# EAGLE design controller (EAGLE 7.7.0)
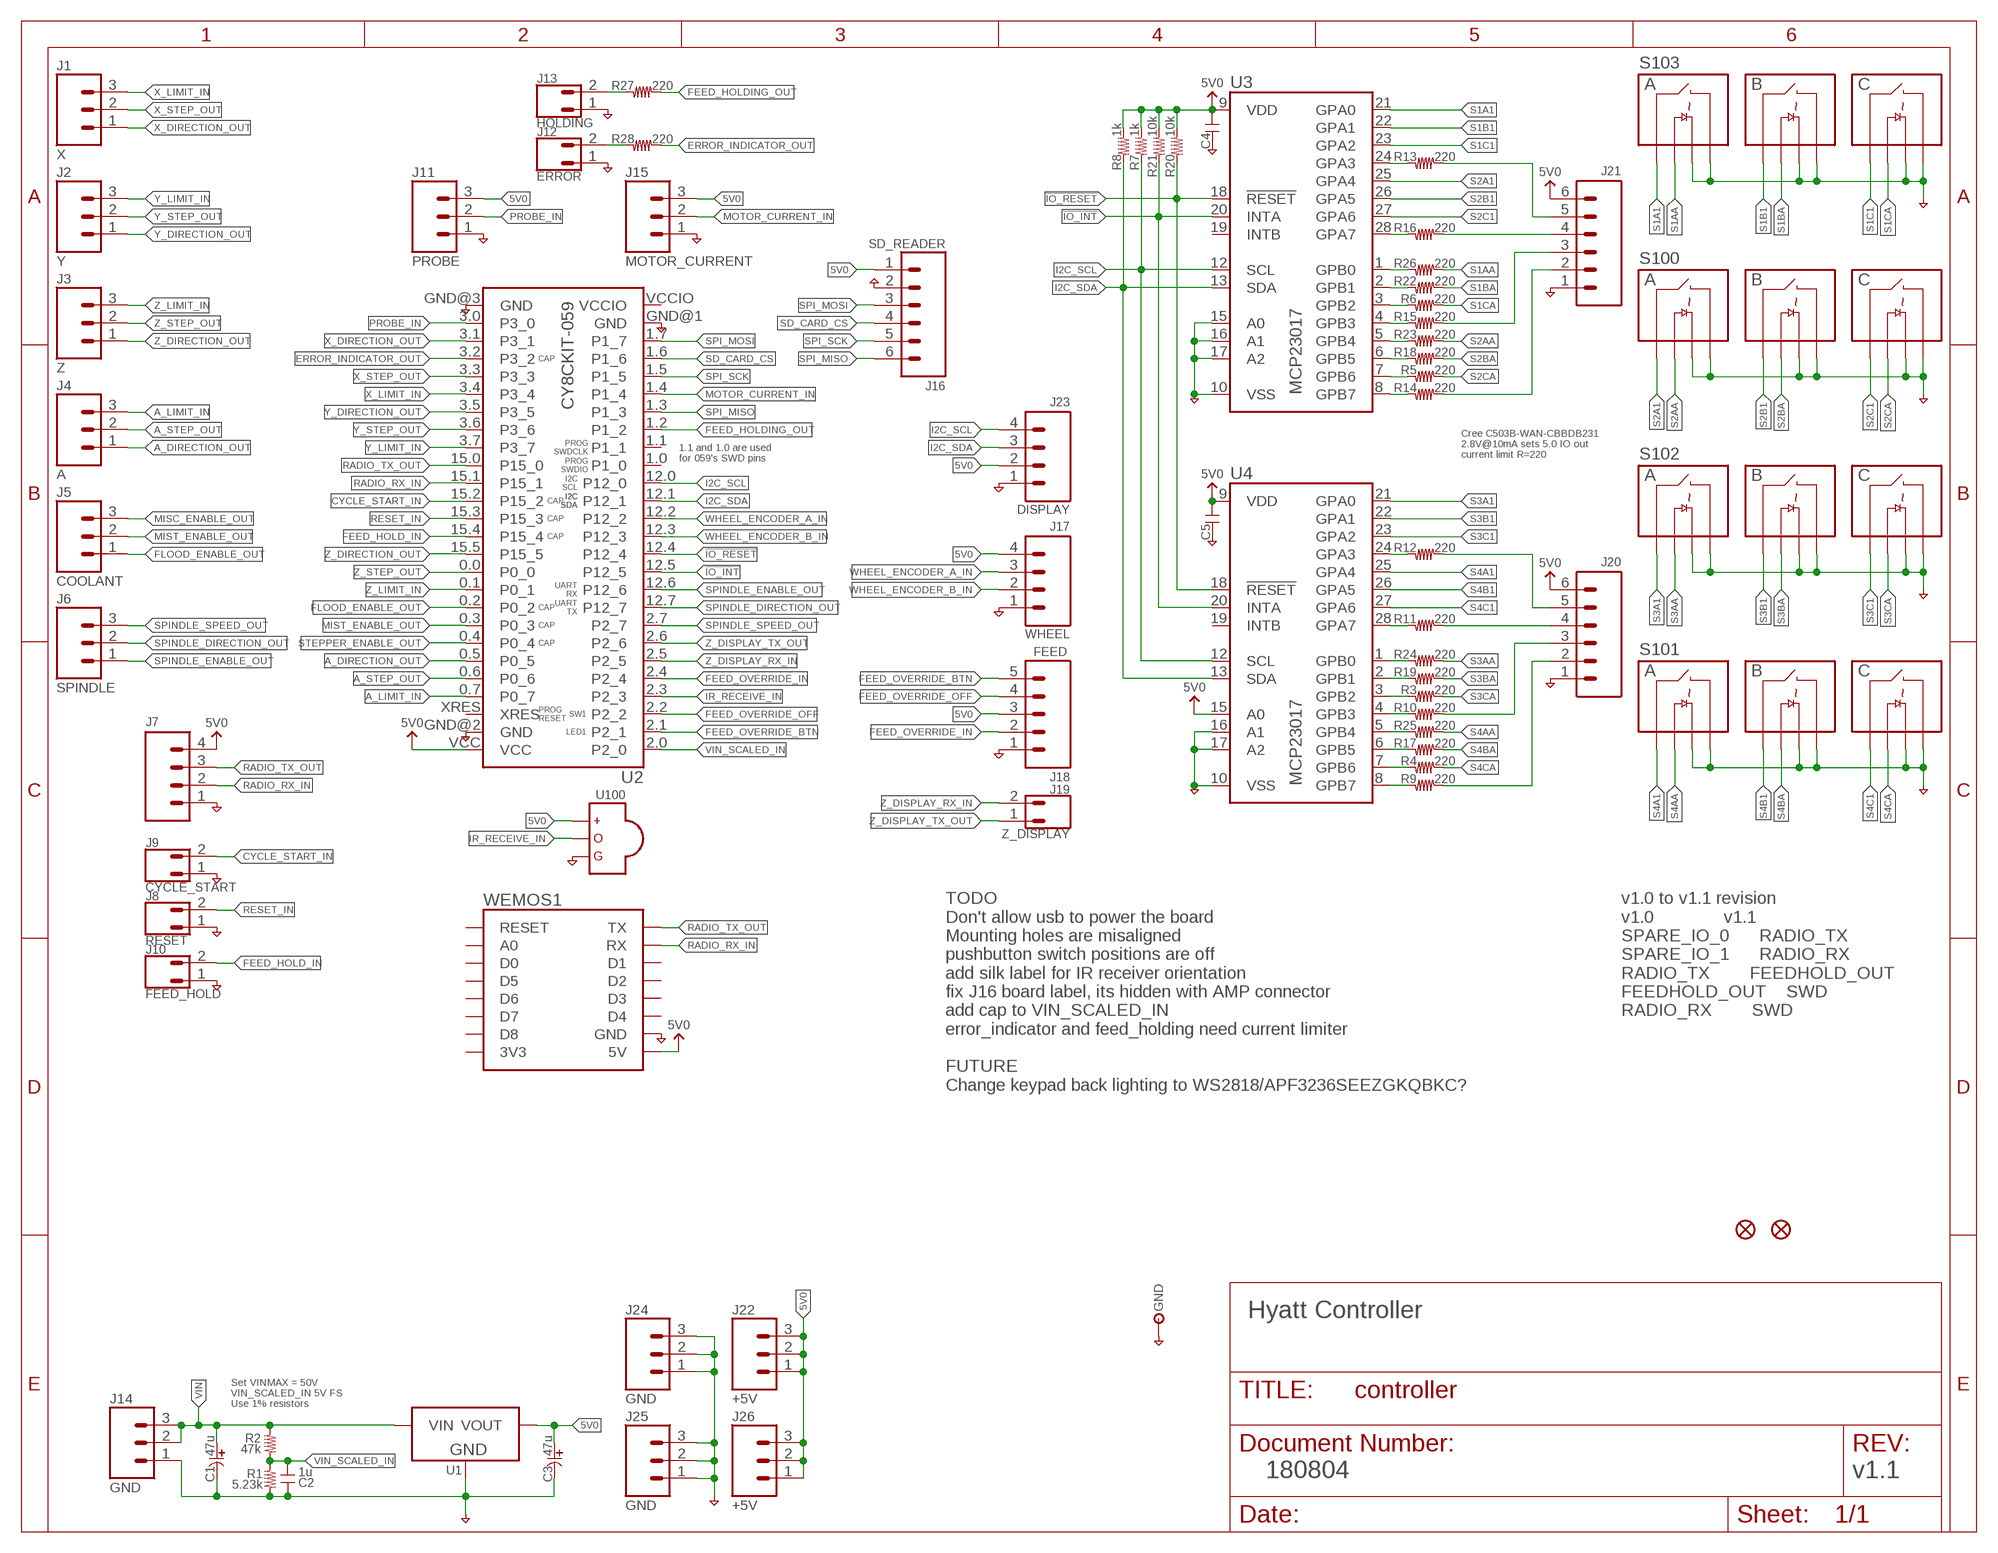
[diagram p0: schematic, sheet 1]

## Parts
C1  47u  C-POLARIZED-E5-10  [E5-10]
C2  1u  C-0603  [C0603]
C3  47u  C-POLARIZED-E5-10  [E5-10]
C4  C-0603  [C0603]
C5  C-0603  [C0603]
FID1  FIDUCIAL1.5X3  [FIDUCIAL-1.5X3]
FID2  FIDUCIAL1.5X3  [FIDUCIAL-1.5X3]
GND  TESTPOINTTHRU  [TPTHRU]
J1  X  CONN-03-3.81MM-PLUGIN-SCREW  [CONN-3.81MM-KF2EDG-3]
J2  Y  CONN-03-3.81MM-PLUGIN-SCREW  [CONN-3.81MM-KF2EDG-3]
J3  Z  CONN-03-3.81MM-PLUGIN-SCREW  [CONN-3.81MM-KF2EDG-3]
J4  A  CONN-03-3.81MM-PLUGIN-SCREW  [CONN-3.81MM-KF2EDG-3]
J5  COOLANT  CONN-03-3.81MM-PLUGIN-SCREW  [CONN-3.81MM-KF2EDG-3]
J6  SPINDLE  CONN-03-3.81MM-PLUGIN-SCREW  [CONN-3.81MM-KF2EDG-3]
J7  CONN-04-0.1  [1X04]
J8  RESET  CONN-02-.100-VERT-HEADER  [CONN-.100-2]
J9  CYCLE_START  CONN-02-.100-VERT-HEADER  [CONN-.100-2]
J10  FEED_HOLD  CONN-02-.100-VERT-HEADER  [CONN-.100-2]
J11  PROBE  CONN-03-3.81MM-PLUGIN-SCREW  [CONN-3.81MM-KF2EDG-3]
J12  ERROR  CONN-02-.100-VERT-HEADER  [CONN-.100-2]
J13  HOLDING  CONN-02-.100-VERT-HEADER  [CONN-.100-2]
J14  GND  CONN-03-3.81MM-PLUGIN-SCREW  [CONN-3.81MM-KF2EDG-3]
J15  MOTOR_CURRENT  CONN-03-3.81MM-PLUGIN-SCREW  [CONN-3.81MM-KF2EDG-3]
J16  SD_READER  CONN-06-0.1  [1X06]
J17  WHEEL  CONN-04-.100-VERT-HEADER  [CONN-.100-4]
J18  FEED  CONN-05-PTH  [1X05]
J19  Z_DISPLAY  CONN-02-3.81MM-PLUGIN-SCREW  [CONN-3.81MM-KF2EDG-2]
J20  CONN-06-.100-VERT-HEADER  [CONN-.100-6]
J21  CONN-06-.100-VERT-HEADER  [CONN-.100-6]
J22  +5V  CONN-03-3.81MM-PLUGIN-SCREW  [CONN-3.81MM-KF2EDG-3]
J23  DISPLAY  CONN-04-.100-VERT-HEADER  [CONN-.100-4]
J24  GND  CONN-03-3.81MM-PLUGIN-SCREW  [CONN-3.81MM-KF2EDG-3]
J25  GND  CONN-03-3.81MM-PLUGIN-SCREW  [CONN-3.81MM-KF2EDG-3]
J26  +5V  CONN-03-3.81MM-PLUGIN-SCREW  [CONN-3.81MM-KF2EDG-3]
R1  5.23k  R-0603  [R0603]
R2  47k  R-0603  [R0603]
R3  220  R-0603  [R0603]
R4  220  R-0603  [R0603]
R5  220  R-0603  [R0603]
R6  220  R-0603  [R0603]
R7  1k  R-0603  [R0603]
R8  1k  R-0603  [R0603]
R9  220  R-0603  [R0603]
R10  220  R-0603  [R0603]
R11  220  R-0603  [R0603]
R12  220  R-0603  [R0603]
R13  220  R-0603  [R0603]
R14  220  R-0603  [R0603]
R15  220  R-0603  [R0603]
R16  220  R-0603  [R0603]
R17  220  R-0603  [R0603]
R18  220  R-0603  [R0603]
R19  220  R-0603  [R0603]
R20  10k  R-0603  [R0603]
R21  10k  R-0603  [R0603]
R22  220  R-0603  [R0603]
R23  220  R-0603  [R0603]
R24  220  R-0603  [R0603]
R25  220  R-0603  [R0603]
R26  220  R-0603  [R0603]
R27  220  R-0603  [R0603]
R28  220  R-0603  [R0603]
S100  SWITCH-DTMF-3-LED  [SWITCH-DTMF-3-LED]
S101  SWITCH-DTMF-3-LED  [SWITCH-DTMF-3-LED]
S102  SWITCH-DTMF-3-LED  [SWITCH-DTMF-3-LED]
S103  SWITCH-DTMF-3-LED  [SWITCH-DTMF-3-LED]
U1  VREG-SIP3  [VREG-SIP3]
U2  BOARD-PSOC-CY8CKIT-059  [BOARD-PSOC-CY8CKIT-059]
U3  MCP23017  IO-MCP23017SO  [SO28W]
U4  MCP23017  IO-MCP23017SO  [SO28W]
U100  SENSOR-IR-THRU  [IRDETECTOR-THRU]
WEMOS1  RADIO-WEMOS-D1-MINI  [WEMOS-D1-MINI]

## Nets
5V0: C3.+ C4.1 C5.1 J7.4 J11.3 J15.3 J16.1 J17.4 J18.3 J20.6 J21.6 J22.1 J22.2 J22.3 J23.2 J26.1 J26.2 J26.3 R7.2 R8.2 R20.2 R21.2 U1.3(VOUT) U2.VCC U3.9(VDD) U4.9(VDD) U4.15(A0) U100.VCC WEMOS1.5V
!IO_INT: R21.1 U2.12.5(P12_5) U3.20(INTA) U4.20(INTA)
!IO_RESET: R20.1 U2.12.4(P12_4) U3.18(!RESET) U4.18(!RESET)
A_DIRECTION_OUT: J4.1 U2.0.5(P0_5)
A_LIMIT_IN: J4.3 U2.0.7(P0_7)
A_STEP_OUT: J4.2 U2.0.6(P0_6)
CYCLE_START_IN: J9.2 U2.15.2(P15_2)
ERROR_INDICATOR_OUT: R28.2 U2.3.2(P3_2)
FEED_HOLD_IN: J10.2 U2.15.4(P15_4)
FEED_HOLDING_OUT: R27.2 U2.1.2(P1_2)
FEED_OVERRIDE_BTN: J18.5 U2.2.1(P2_1)
FEED_OVERRIDE_IN: J18.2 U2.2.4(P2_4)
FEED_OVERRIDE_OFF: J18.4 U2.2.2(P2_2)
FLOOD_ENABLE_OUT: J5.1 U2.0.2(P0_2)
GND: C1.- C2.2 C3.- C4.2 C5.2 GND.1 J7.1 J8.1 J9.1 J10.1 J11.1 J12.1 J13.1 J14.1 J15.1 J16.2 J17.1 J18.1 J20.1 J21.1 J23.1 J24.1 J24.2 J24.3 J25.1 J25.2 J25.3 R1.1 S100.A_2 S100.A_C S100.B_2 S100.B_C S100.C_2 S100.C_C S101.A_2 S101.A_C S101.B_2 S101.B_C S101.C_2 S101.C_C S102.A_2 S102.A_C S102.B_2 S102.B_C S102.C_2 S102.C_C S103.A_2 S103.A_C S103.B_2 S103.B_C S103.C_2 S103.C_C U1.2(GND) U2.GND@1(GND) U2.GND@2(GND) U2.GND@3(GND) U3.10(VSS) U3.15(A0) U3.16(A1) U3.17(A2) U4.10(VSS) U4.16(A1) U4.17(A2) U100.GND WEMOS1.GND
I2C_SCL: J23.4 R7.1 U2.12.0(P12_0) U3.12(SCL) U4.12(SCL)
I2C_SDA: J23.3 R8.1 U2.12.1(P12_1) U3.13(SDA) U4.13(SDA)
IR_RECEIVE_IN: U2.2.3(P2_3) U100.VOUT
MISC_ENABLE_OUT: J5.3
MIST_ENABLE_OUT: J5.2 U2.0.3(P0_3)
MOTOR_CURRENT_IN: J15.2 U2.1.4(P1_4)
N$1: R26.1 U3.1(GPB0)
N$2: R22.1 U3.2(GPB1)
N$3: R13.1 U3.24(GPA3)
N$4: J21.5 R13.2
N$5: R16.1 U3.28(GPA7)
N$6: J21.3 R15.2
N$7: J21.4 R16.2
N$8: R12.1 U4.24(GPA3)
N$9: R11.1 U4.28(GPA7)
N$10: J20.5 R12.2
N$11: J20.4 R11.2
N$12: J13.2 R27.1
N$13: J12.2 R28.1
N$15: R6.1 U3.3(GPB2)
N$16: R15.1 U3.4(GPB3)
N$17: R23.1 U3.5(GPB4)
N$18: R18.1 U3.6(GPB5)
N$19: R5.1 U3.7(GPB6)
N$20: R14.1 U3.8(GPB7)
N$21: R24.1 U4.1(GPB0)
N$22: R19.1 U4.2(GPB1)
N$23: R3.1 U4.3(GPB2)
N$24: R10.1 U4.4(GPB3)
N$25: R25.1 U4.5(GPB4)
N$26: R17.1 U4.6(GPB5)
N$27: R4.1 U4.7(GPB6)
N$28: R9.1 U4.8(GPB7)
N$30: J21.2 R14.2
N$44: J20.3 R10.2
N$48: J20.2 R9.2
PROBE_IN: J11.2 U2.3.0(P3_0)
RADIO_RX_IN: J7.2 U2.15.1(P15_1) WEMOS1.RX
RADIO_TX_OUT: J7.3 U2.15.0(P15_0) WEMOS1.TX
RESET_IN: J8.2 U2.15.3(P15_3)
S1A1: S103.A_1 U3.21(GPA0)
S1AA: R26.2 S103.A_A
S1B1: S103.B_1 U3.22(GPA1)
S1BA: R22.2 S103.B_A
S1C1: S103.C_1 U3.23(GPA2)
S1CA: R6.2 S103.C_A
S2A1: S100.A_1 U3.25(GPA4)
S2AA: R23.2 S100.A_A
S2B1: S100.B_1 U3.26(GPA5)
S2BA: R18.2 S100.B_A
S2C1: S100.C_1 U3.27(GPA6)
S2CA: R5.2 S100.C_A
S3A1: S102.A_1 U4.21(GPA0)
S3AA: R24.2 S102.A_A
S3B1: S102.B_1 U4.22(GPA1)
S3BA: R19.2 S102.B_A
S3C1: S102.C_1 U4.23(GPA2)
S3CA: R3.2 S102.C_A
S4A1: S101.A_1 U4.25(GPA4)
S4AA: R25.2 S101.A_A
S4B1: S101.B_1 U4.26(GPA5)
S4BA: R17.2 S101.B_A
S4C1: S101.C_1 U4.27(GPA6)
S4CA: R4.2 S101.C_A
SD_CARD_CS: J16.4 U2.1.6(P1_6)
SPI_MISO: J16.6 U2.1.3(P1_3)
SPI_MOSI: J16.3 U2.1.7(P1_7)
SPI_SCK: J16.5 U2.1.5(P1_5)
SPINDLE_DIRECTION_OUT: J6.2 U2.12.7(P12_7)
SPINDLE_ENABLE_OUT: J6.1 U2.12.6(P12_6)
SPINDLE_SPEED_OUT: J6.3 U2.2.7(P2_7)
STEPPER_ENABLE_OUT: U2.0.4(P0_4)
VIN: C1.+ J14.2 J14.3 R2.2 U1.1(VIN)
VIN_SCALED_IN: C2.1 R1.2 R2.1 U2.2.0(P2_0)
WHEEL_ENCODER_A_IN: J17.3 U2.12.2(P12_2)
WHEEL_ENCODER_B_IN: J17.2 U2.12.3(P12_3)
X_DIRECTION_OUT: J1.1 U2.3.1(P3_1)
X_LIMIT_IN: J1.3 U2.3.4(P3_4)
X_STEP_OUT: J1.2 U2.3.3(P3_3)
Y_DIRECTION_OUT: J2.1 U2.3.5(P3_5)
Y_LIMIT_IN: J2.3 U2.3.7(P3_7)
Y_STEP_OUT: J2.2 U2.3.6(P3_6)
Z_DIRECTION_OUT: J3.1 U2.15.5(P15_5)
Z_DISPLAY_RX_IN: J19.2 U2.2.5(P2_5)
Z_DISPLAY_TX_OUT: J19.1 U2.2.6(P2_6)
Z_LIMIT_IN: J3.3 U2.0.1(P0_1)
Z_STEP_OUT: J3.2 U2.0.0(P0_0)
Unconnected: U2.1.0(P1_0) U2.1.1(P1_1) U2.VCCIO U2.XRES U3.19(INTB) U4.19(INTB) WEMOS1.3V3 WEMOS1.A0 WEMOS1.D0 WEMOS1.D1 WEMOS1.D2 WEMOS1.D3 WEMOS1.D4 WEMOS1.D5 WEMOS1.D6 WEMOS1.D7 WEMOS1.D8 WEMOS1.RESET

## Notes on the sheet
- Cree C503B-WAN-CBBDB231
  2.8V@10mA sets 5.0 IO out
  current limit R=220
- 1.1 and 1.0 are used
  for 059's SWD pins
- TODO
  Don't allow usb to power the board
  Mounting holes are misaligned
  pushbutton switch positions are off
  add silk label for IR receiver orientation
  fix J16 board label, its hidden with AMP connector
  add cap to VIN_SCALED_IN
  error_indicator and feed_holding need current limiter
  
  FUTURE
  Change keypad back lighting to WS2818/APF3236SEEZGKQBKC?
- v1.0 to v1.1 revision
  v1.0              v1.1
  SPARE_IO_0      RADIO_TX
  SPARE_IO_1      RADIO_RX
  RADIO_TX        FEEDHOLD_OUT
  FEEDHOLD_OUT    SWD
  RADIO_RX        SWD
- Hyatt Controller
- Set VINMAX = 50V
  VIN_SCALED_IN 5V FS
  Use 1% resistors
- 180804 | v1.1

## Library data of the parts
C1 C3 = holla:C-POLARIZED
C2 C4 C5 = holla:C
FID1 FID2 = holla:FIDUCIAL: Fiducial Alignment Points Various fiducial points for machine vision alignment.; DNP: 1
GND = holla:TESTPOINT; DNP: 1
J1-J6 J11 J14 J15 J22 J24-J26 = holla:CONN-03
J7 J17 J23 = holla:CONN-04
J8-J10 J12 J13 J19 = holla:CONN-02: CONN HEADER 2POS
J16 J20 J21 = holla:CONN-06
J18 = holla:CONN-05: Header 5 Standard 5-pin 0.1" header. Use with straight break away headers (SKU : PRT-00116), right angle break away headers (PRT-00553), swiss pins (PRT-00743), machine pins (PRT-00117), and female headers (PRT-00115). Molex polarized connector foot print use with SKU : PRT-08230 with associated crimp pins and housings.
R1-R28 = holla:R; DESC: 5%
S100-S103 = holla:SWITCH-DTMF-3-LED
U1 = holla:VREG: Various 3 pin voltage regulators in different packages Double check the right pinout for the right part
U2 = holla:BOARD-PSOC-CY8CKIT-059
U3 U4 = holla:IO-MCP23017: 16-bit input/output port expander with interrupt output http://ww1.microchip.com/downloads/en/DeviceDoc/21952a.pdf Source: http://ww1.microchip.com/downloads/en/DeviceDoc/21952a.pdf; MF: MICROCHIP; MPN: MCP23017-E/SO; OC_FARNELL: 1332087; OC_NEWARK: 31K2958
U100 = holla:SENSOR-IR: IR Detector PTH equiv GP1UX311QS or TSOP38238 SMD TSOP6238TT
WEMOS1 = holla:RADIO-WEMOS-D1-MINI: WeMos.cc D1 mini ESP8266 module

## Board
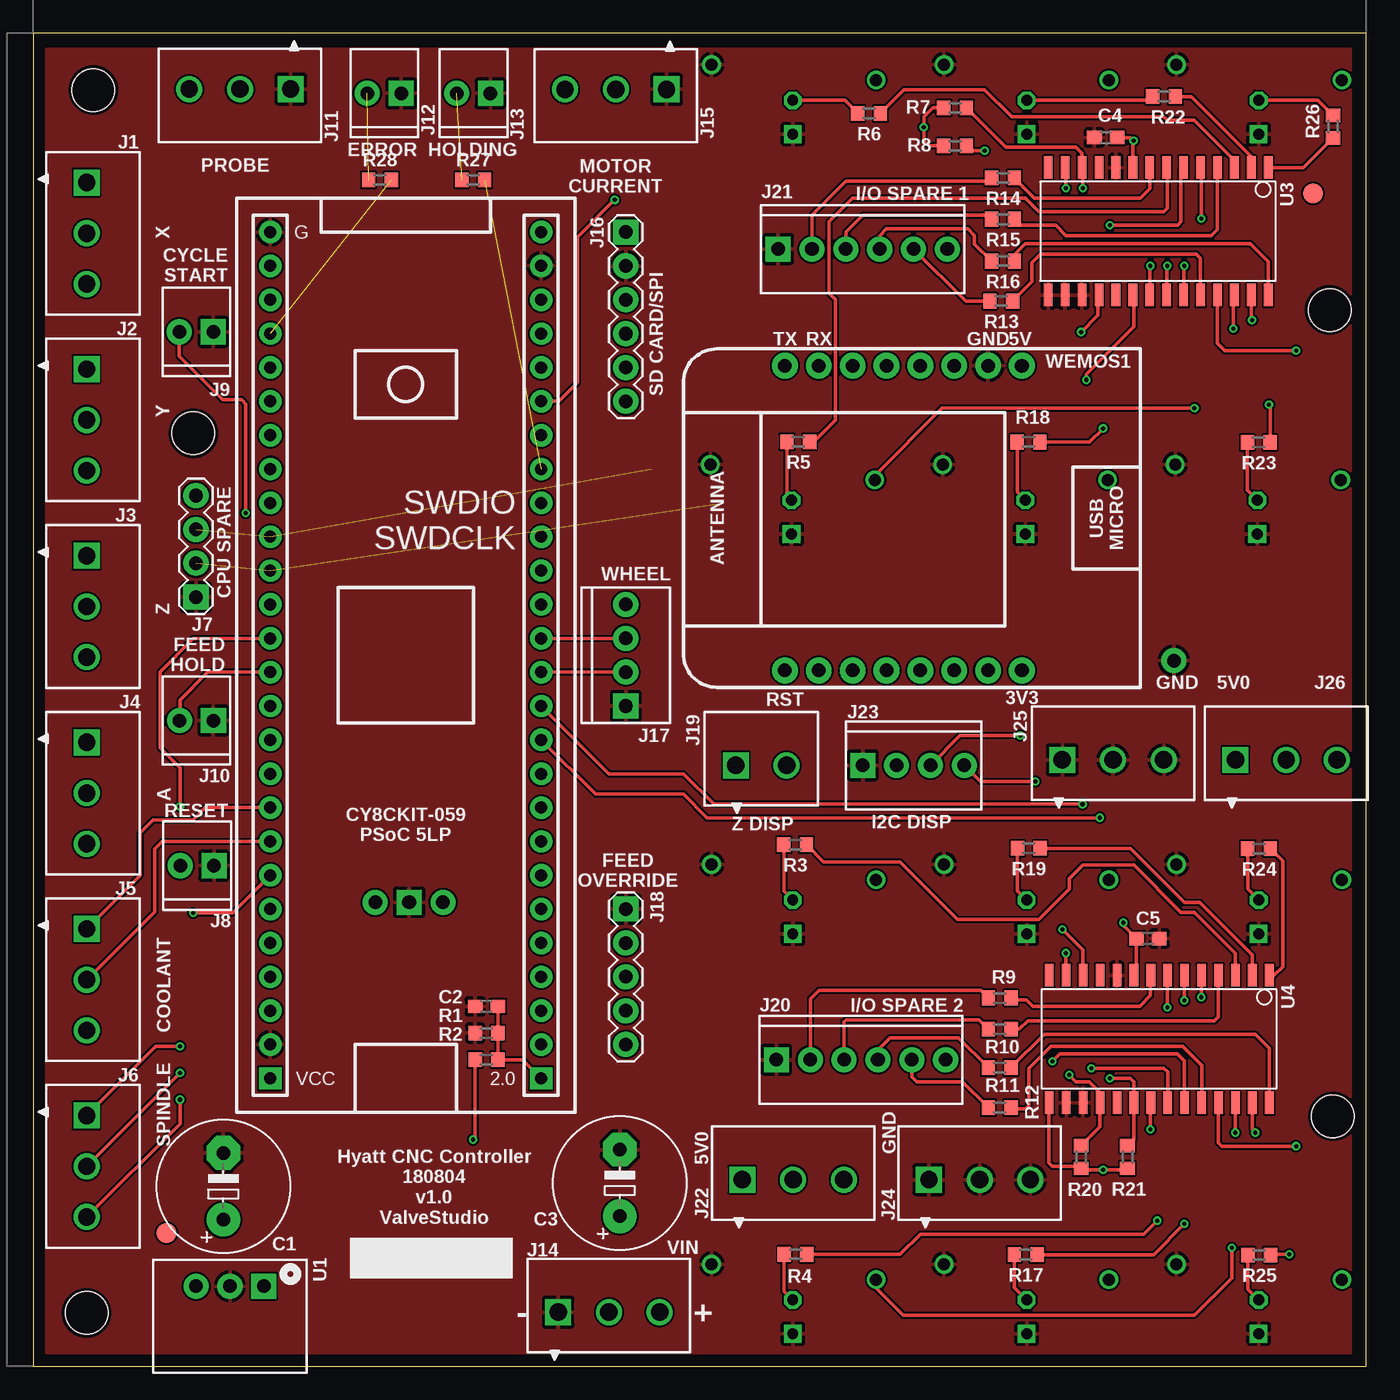
[diagram p1: board, top side]
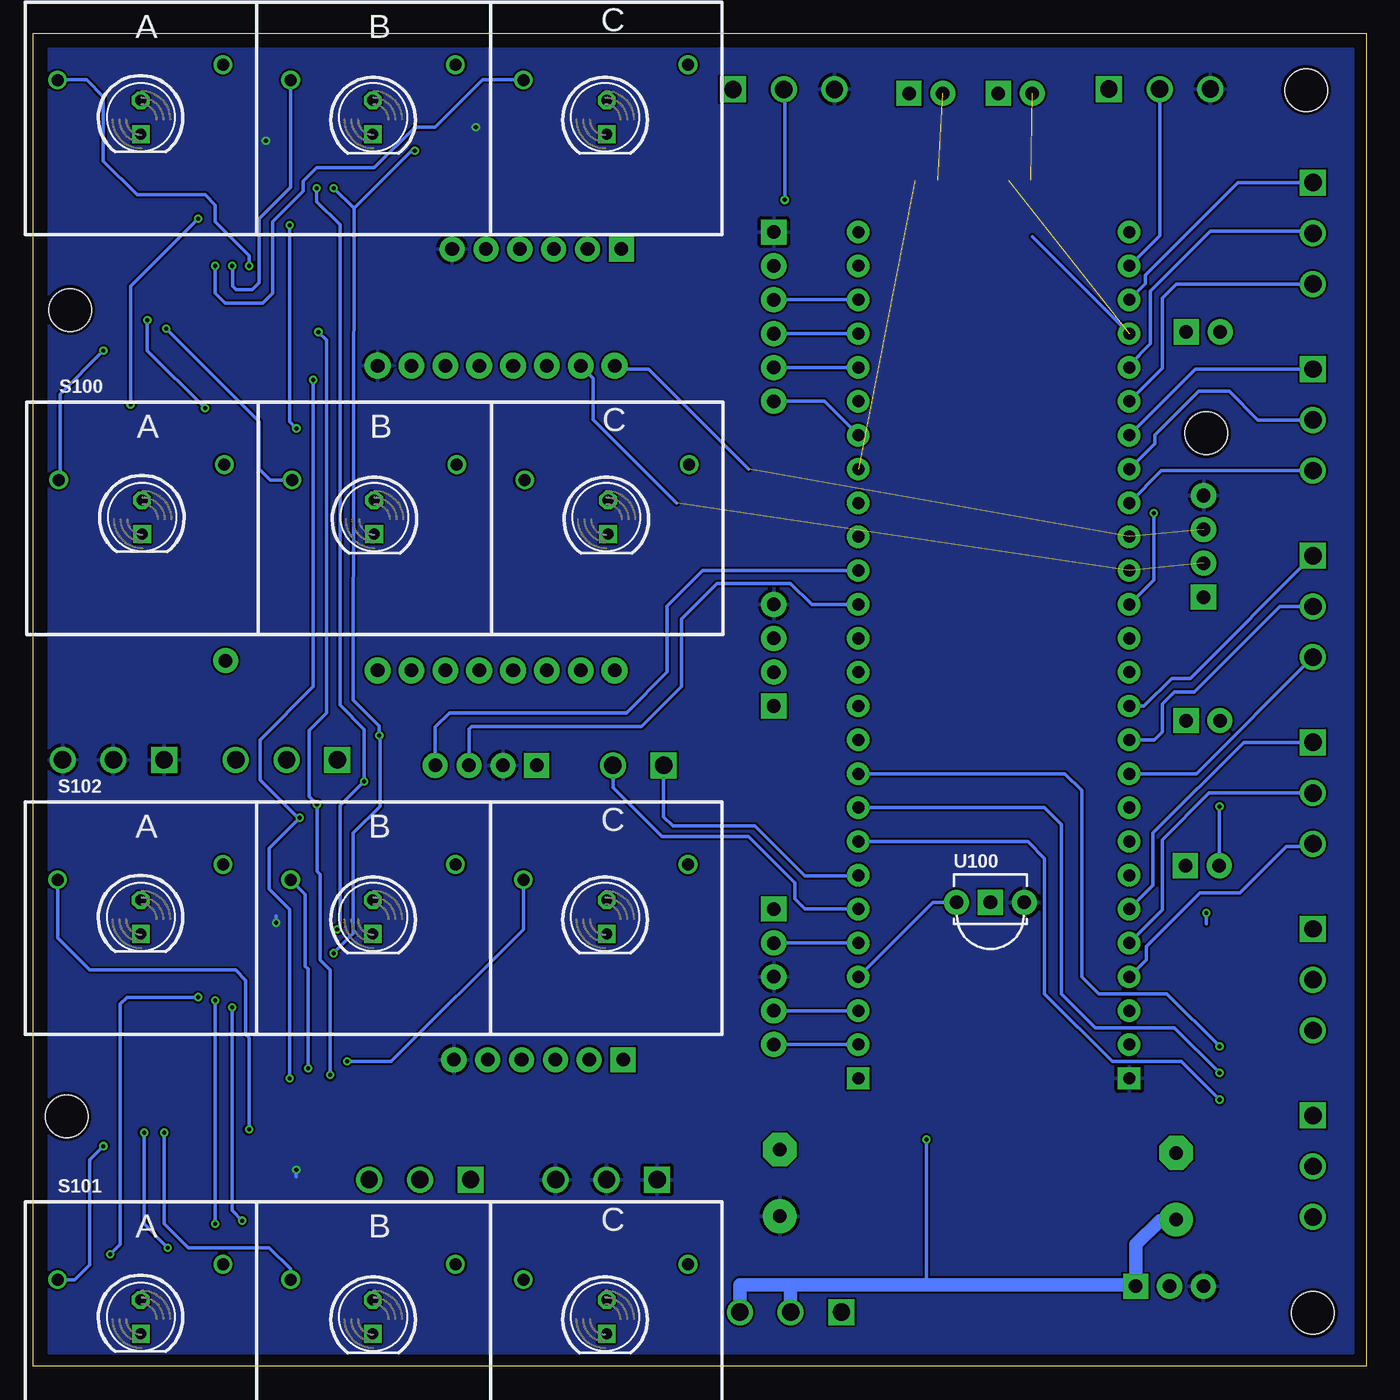
[diagram p2: board, bottom side, seen from below]

Size 100 x 100 mm. Coordinates in mm from the lower left corner, seen from the top.
Outline: 0,0 100,0 100,100 0,100 0,0
Copper layers (1*16): Top 0.035mm / dielectric 1.5mm / Bottom 0.035mm
Design rules "Fusion_eagle_rule_v1.1": minimum track width 6mil, minimum drill 12mil, track to track 6mil, track to pad 6mil, pad to pad 6mil, via to via 6mil, smd to smd 0mil, copper to edge 10mil, drill to drill 10mil, minimum pad ring 10mil, minimum via ring 6mil, stop-mask expansion 2mil, vias tented up to drill 100mil, thermal gap 10mil
Holes 3.2 mm at 97.25,79.25 97.5,18.75 4.5,95.75 4,4 12,70

### Footprints (pad centres in the part's own frame; a part is rotated, then mirrored left to right if it is on the bottom)
E5-10 = drill 1.016 pad 2.54: + -2.5,0 | drill 1.016 pad 2.54 octagon: - 2.5,0
C0603 = smd 1.1 x 1: 1 -0.85,0; 2 0.85,0
FIDUCIAL-1.5X3 = smd 1.5 x 1.5: 1 0,0
TPTHRU = drill 1.016 pad 1.88: 1 0,0
CONN-3.81MM-KF2EDG-3 = drill 1.3 square: 1 -3.81,0 | drill 1.3: 2 0,0; 3 3.81,0
1X04 = drill 1.016 pad 1.88 square: 1 0,0 | drill 1.016 pad 1.88: 2 2.54,0; 3 5.08,0; 4 7.62,0
CONN-.100-2 = drill 1.016 pad 1.88 square: 1 0,0 | drill 1.016 pad 1.88: 2 2.54,0
1X06 = drill 1.016 pad 1.88 square: 1 0,0 | drill 1.016 pad 1.88: 2 2.54,0; 3 5.08,0; 4 7.62,0; 5 10.16,0; 6 12.7,0
CONN-.100-4 = drill 1.016 pad 1.88 square: 1 0,0 | drill 1.016 pad 1.88: 2 2.54,0; 3 5.08,0; 4 7.62,0
1X05 = drill 1.016 pad 1.88 square: 1 0,0 | drill 1.016 pad 1.88: 2 2.54,0; 3 5.08,0; 4 7.62,0; 5 10.16,0
CONN-3.81MM-KF2EDG-2 = drill 1.3 square: 1 -1.905,0 | drill 1.3: 2 1.905,0
CONN-.100-6 = drill 1.016 pad 1.88 square: 1 0,0 | drill 1.016 pad 1.88: 2 2.54,0; 3 5.08,0; 4 7.62,0; 5 10.16,0; 6 12.7,0
R0603 = smd 1 x 1.1: 1 -0.85,0; 2 0.85,0
SWITCH-DTMF-3-LED = drill 0.9: A_1 2.416,11.6; A_2 14.83,12.75; B_1 19.9,11.6; B_2 32.271,12.75; C_1 37.368,11.6; C_2 49.712,12.75 | drill 0.813 octagon: A_A 8.66,10.07; B_A 26.067,10.07; C_A 43.62,10.07 | drill 0.813 square: A_C 8.668,7.53; B_C 26.067,7.53; C_C 43.62,7.53
VREG-SIP3 = drill 1.016 pad 1.88 square: 1 -2.54,0 | drill 1.016 pad 1.88: 2 0,0; 3 2.54,0
BOARD-PSOC-CY8CKIT-059 = drill 0.9 pad 1.676: 0.0 10.16,6.35; 0.1 10.16,8.89; 0.2 10.16,11.43; 0.3 10.16,13.97; 0.4 10.16,16.51; 0.5 10.16,19.05; 0.6 10.16,21.59; 0.7 10.16,24.13; 1.0 -10.16,-8.89; 1.1 -10.16,-11.43; 1.2 -10.16,-13.97; 1.3 -10.16,-16.51; 1.4 -10.16,-19.05; 1.5 -10.16,-21.59; 1.6 -10.16,-24.13; 1.7 -10.16,-26.67; 2.1 -10.16,29.21; 2.2 -10.16,26.67; 2.3 -10.16,24.13; 2.4 -10.16,21.59; 2.5 -10.16,19.05; 2.6 -10.16,16.51; 2.7 -10.16,13.97; 3.0 10.16,-29.21; 3.1 10.16,-26.67; 3.2 10.16,-24.13; 3.3 10.16,-21.59; 3.4 10.16,-19.05; 3.5 10.16,-16.51; 3.6 10.16,-13.97; 3.7 10.16,-11.43; 12.0 -10.16,-6.35; 12.1 -10.16,-3.81; 12.2 -10.16,-1.27; 12.3 -10.16,1.27; 12.4 -10.16,3.81; 12.5 -10.16,6.35; 12.6 -10.16,8.89; 12.7 -10.16,11.43; 15.0 10.16,-8.89; 15.1 10.16,-6.35; 15.2 10.16,-3.81; 15.3 10.16,-1.27; 15.4 10.16,1.27; 15.5 10.16,3.81; GND@1 -10.16,-29.21; GND@2 10.16,29.21; GND@3 10.16,-31.75; VCCIO -10.16,-31.75; XRES 10.16,26.67 | drill 0.9 pad 1.676 square: 2.0 -10.16,31.75; VCC 10.16,31.75
SO28W = smd 0.65 x 1.7: 1 -7.62,-4.78; 2 -6.35,-4.78; 3 -5.08,-4.78; 4 -3.81,-4.78; 5 -2.54,-4.78; 6 -1.27,-4.78; 7 0,-4.78; 8 1.27,-4.78; 9 2.54,-4.78; 10 3.81,-4.78; 11 5.08,-4.78; 12 6.35,-4.78; 13 7.62,-4.78; 14 8.89,-4.78; 15 8.89,4.78; 16 7.62,4.78; 17 6.35,4.78; 18 5.08,4.78; 19 3.81,4.78; 20 2.54,4.78; 21 1.27,4.78; 22 0,4.78; 23 -1.27,4.78; 24 -2.54,4.78; 25 -3.81,4.78; 26 -5.08,4.78; 27 -6.35,4.78; 28 -7.62,4.78
IRDETECTOR-THRU = drill 1.016 pad 1.88 square: GND 0,0 | drill 1.016 pad 1.88: VCC 2.54,0; VOUT -2.54,0
WEMOS-D1-MINI = drill 1.016 pad 1.93: 3V3 -11.43,-10.16; 5V 11.43,-10.16; A0 -11.43,5.08; D0 -11.43,2.54; D1 11.43,2.54; D2 11.43,0; D3 11.43,-2.54; D4 11.43,-5.08; D5 -11.43,0; D6 -11.43,-2.54; D7 -11.43,-5.08; D8 -11.43,-7.62; GND 11.43,-7.62; RESET -11.43,7.62; RX 11.43,5.08; TX 11.43,7.62

### Placement (x,y rotation side)
C1  14.26,13.5 90 top
C2  34,27 180 top
C3  44,13.75 90 top
C4  80.46,92.18 180 top
C5  83.62,32.09 0 top
FID1  10,10 0 top
FID2  96,88 0 top
GND  85.57,52.94 0 top
J1  4,85 270 top
J2  4,71 270 top
J3  4,57 270 top
J4  4,43 270 top
J5  4,29 270 top
J6  4,15 270 top
J7  12.2,57.7 90 top
J8  13.56,37.55 180 top
J9  13.5,77.6 180 top
J10  13.51,48.44 180 top
J11  15.5,95.82 180 top
J12  27.6,95.5 180 top
J13  34.3,95.5 180 top
J14  43.19,4.06 0 top
J15  43.7,95.8 180 top
J16  44.45,85.09 270 top
J17  44.45,49.53 90 top
J18  44.45,34.29 270 top
J19  54.61,45.09 0 top
J20  55.75,23 0 top
J21  55.88,83.82 0 top
J22  57,14 0 top
J23  62.23,45.09 0 top
J24  71,14 0 top
J25  81,45.5 0 top
J26  94,45.5 0 top
R1  34,25 0 top
R2  34,23 180 top
R3  57.16,39.13 180 top
R4  57.18,8.39 180 top
R5  57.4,69.35 180 top
R6  62.71,93.99 180 top
R7  69.16,94.4 180 top
R8  69.16,91.55 180 top
R9  72.5,27.63 180 top
R10  72.5,25.29 180 top
R11  72.5,22.4 180 top
R12  72.5,19.4 180 top
R13  72.62,79.91 180 top
R14  72.75,89.15 180 top
R15  72.75,86.05 180 top
R16  72.75,82.91 180 top
R17  74.45,8.37 180 top
R18  74.67,69.33 180 top
R19  74.69,38.85 180 top
R20  78.61,15.69 270 top
R21  82.08,15.69 270 top
R22  84.84,95.25 180 top
R23  91.94,69.31 180 top
R24  91.96,38.83 180 top
R25  91.98,8.35 180 top
R26  97.5,93 90 top
R27  33,89 0 top
R28  26,89 0 top
S100  100.5,54.9 0 bottom
S101  100.6,-5.1 0 bottom
S102  100.6,24.9 0 bottom
S103  100.6,84.9 0 bottom
U1  14.75,6 180 top
U2  27.94,53.34 180 top
U3  85.03,85.15 180 top
U4  85.11,24.55 180 top
U100  28.19,34.8 0 bottom
WEMOS1  64.01,63.63 90 top

### Tracks (layer width: path | path; a pad name or v marks a point on that pad's centre or on a via)
5V0  (via drill 0.3)
  Top 0.254: R7.2 67.48,94.4 66.8,93.73 v66.8,92.96 66.8,91.95 67.2,91.55 R8.2 | C4.1 82.32,92.18 v82.55,91.95 82.49,91.89 U3.9 | U4.15 76.2,19.75 76.2,15.24 76.45,14.99 78.46,14.99 R20.2 78.72,14.73 v80.26,14.73 81.97,14.73 R21.2 | v81.79,33.27 81.79,33.07 C5.1 82.77,29.53 U4.9
  Bottom 0.254: v66.8,92.96 66.55,92.96 | v82.55,91.95 82.8,91.95 | v81.79,33.27 81.79,33.78 | v80.26,14.73 80.26,14.22
  pour Bottom: 1.02,98.81 98.81,98.81 98.81,1.02 1.02,1.02
!IO_INT  (via drill 0.3)
  Top 0.254: U3.20 82.55,80.31 82.55,77.99 79,74.44 v79,74 | R21.1 82.57,17.03 U4.20 82.55,19.77 82.55,21.34 82.3,21.59 v80.76,21.59 | v80.01,41.15 50.55,41.15 48.77,42.93 42.16,42.93 U2.12.5
  Bottom 0.254: v79,74 79,51 83,47 83,44 80.15,41.15 v80.01,41.15 82.3,38.86 82.3,35.81 80.76,34.28 v80.76,21.59
!IO_RESET  (via drill 0.3)
  Top 0.254: U3.18 79.88,80.3 79.88,78.87 v78.61,77.6 | U4.18 80.01,19.79 | R20.1 80.03,17.97 U4.18 | v78.72,42.16 51.05,42.16 48.77,44.45 43.18,44.45 U2.12.4 | v77.72,21.84 78.23,21.34 79.25,21.34 80.03,20.55 U4.18
  Bottom 0.254: v77.72,21.84 77.72,29.72 78.49,30.48 78.49,36.89 78.72,37.12 v78.72,42.16 79.3,42.74 79.3,47.7 78,49 78,76.98 v78.61,77.6
A_DIRECTION_OUT
  Bottom 0.254: J4.1 9.19,46.81 16,40 16,36.07 U2.0.5
A_LIMIT_IN
  Bottom 0.254: U2.0.7 16.5,30.49 16.5,31.5 12.5,35.5 9.5,35.5 6,39 4.19,39 J4.3
A_STEP_OUT
  Bottom 0.254: J4.2 11.8,43 15.3,39.5 15.3,34.23 U2.0.6
CYCLE_START_IN  (via drill 0.3)
  Top 0.254: J9.2 10.96,75.78 14.22,72.52 15.62,72.52 15.94,72.2 v15.94,64.01
  Bottom 0.254: v15.94,64.01 15.94,58.99 U2.15.2
ERROR_INDICATOR_OUT  (1 unrouted)
  Bottom 0.254: 25.06,84.75 U2.3.2
FEED_HOLD_IN
  Top 0.254: U2.15.4 13.07,52.07 11,50 11,48.47 J10.2
FEED_HOLDING_OUT  (1 unrouted)
FEED_OVERRIDE_BTN
  Bottom 0.254: J18.5 U2.2.1
FEED_OVERRIDE_IN
  Bottom 0.254: J18.2 U2.2.4
FEED_OVERRIDE_OFF
  Bottom 0.254: J18.4 U2.2.2
FLOOD_ENABLE_OUT
  Top 0.254: U2.0.2 12.91,41.91 12,41 9,41 8,40 8,36.81 J5.1
GND
  pour Top: 1.02,1.02 1.02,98.81 98.81,98.81 98.81,1.02
I2C_SCL  (via drill 0.3)
  Top 0.254: v78.74,88.39 78.74,89.87 U3.12 78.68,90.99 78.23,91.44 72.97,91.44 R7.1 | v77.22,32.77 78.76,31.22 U4.12 | v75.18,43.88 71.06,43.88 J23.4
  Bottom 0.254: v78.74,88.39 78.74,87.38 77,85.64 77,49.6 75.18,47.78 v75.18,43.88 77,42.06 77,32.98 v77.22,32.77 | U2.12.0 49.78,59.69 52.45,57.02 52.45,52.07 55.5,49.02 68.77,49.02 69.85,47.94 J23.4
I2C_SDA  (via drill 0.3)
  Top 0.254: v77.47,88.39 77.47,89.87 U3.13 77.34,89.99 | R8.1 70.38,91.19 v71.37,91.19 | v77.47,30.99 77.47,29.35 U4.13 | v74.04,47.31 69.53,47.31 J23.3
  Bottom 0.254: v77.47,88.39 75.95,86.87 | 75.95,86.87 76,50 74.04,48.04 v74.04,47.31 74,47.27 74,42 76,40 76,32.46 v77.47,30.99 | v71.37,91.19 71.63,91.19 75.95,86.87 | U2.12.1 41.59,57.15 43.18,58.74 48.7,58.74 51.37,56.07 51.37,50.99 54.36,48.01 67.12,48.01 67.31,47.82 J23.3
IR_RECEIVE_IN
  Bottom 0.254: U100.VOUT 32.51,34.8 U2.2.3
MIST_ENABLE_OUT
  Top 0.254: U2.0.3 9.67,39.37 9.1,38.8 9.1,34.1 J5.2
MOTOR_CURRENT_IN  (via drill 0.3)
  Top 0.254: U2.1.4 39.43,72.39 40.83,73.79 40.83,84.71 v43.62,87.5
  Bottom 0.254: v43.62,87.5 43.62,95.72 J15.2
N$1
  Top 0.254: U3.1 95.28,89.93 R26.1
N$2
  Top 0.254: U3.2 91.38,90.74 86.87,95.25 R22.1
N$3
  Top 0.254: R13.1 74.93,81.36 74.93,82.8 75.56,83.44 87.25,83.44 87.57,83.12 U3.24
N$4
  Top 0.254: J21.5 69.95,79.91 R13.2
N$5
  Top 0.254: U3.28 92.65,82.86 91.31,84.2 74.42,84.2 73.6,83.38 R16.1
N$6
  Top 0.254: R15.2 71.59,86.36 62.23,86.36 60.96,85.09 J21.3
N$7
  Top 0.254: R16.2 70.61,84.2 70.61,84.84 70.1,85.34 64.01,85.34 63.5,84.84 J21.4
N$8
  Top 0.254: U4.24 87.65,22.59 86.23,24 76.33,24 74.68,22.35 74.68,19.56 74.42,19.3 73.45,19.3 R12.1
N$9
  Top 0.254: R11.1 75.84,24.89 91.69,24.89 92.73,23.86 U4.28
N$10
  Top 0.254: R12.2 69.72,21.34 66.29,21.34 65.91,21.72 J20.5
N$11
  Top 0.254: R11.2 69.42,24.64 64.26,24.64 63.37,23.75 J20.4
N$12  (1 unrouted)
N$13  (1 unrouted)
N$15
  Top 0.254: R6.1 65.32,95.76 71.37,95.76 73.41,93.73 84.84,93.73 85.09,93.47 87.12,93.47 90.11,90.48 U3.3
N$16
  Top 0.254: U3.4 88.84,85.28 88.39,84.84 77.47,84.84 76.71,85.6 74.05,85.6 R15.1
N$17  (via drill 0.3)
  Top 0.254: U3.5 87.63,89.87 v87.63,86.11 | v92.71,72.14 92.79,72.06 R23.1
  Bottom 0.254: v87.63,86.11 92.71,81.03 v92.71,72.14
N$18  (via drill 0.3)
  Top 0.254: U3.6 86.11,89.73 86.11,85.85 85.85,85.6 v80.77,85.6 | R18.1 79.24,69.33 v80.26,70.36
  Bottom 0.254: v80.77,85.6 80.77,70.87 v80.26,70.36
N$19
  Top 0.254: U3.7 85.09,89.87 85.09,86.87 84.84,86.61 75.44,86.61 74.42,87.63 61.47,87.63 59.69,85.85 59.69,80.52 60.2,80.01 60.2,70.99 58.56,69.35 R5.1
N$20
  Top 0.254: R14.1 75.12,87.63 83.06,87.63 83.76,88.33 U3.8
N$21
  Top 0.254: R24.1 93.73,37.91 93.73,29.97 93.08,29.33 U4.1
N$22
  Top 0.254: U4.2 91.44,29.35 91.44,30.86 87.5,34.8 86.36,34.8 82.31,38.85 R19.1
N$23
  Top 0.254: R3.1 59.29,37.85 65.02,37.85 69.34,33.53 75.44,33.53 77.72,35.81 77.72,36.58 78.74,37.59 82.55,37.59 86.11,34.04 87.12,34.04 90.19,30.97 U4.3
N$24
  Top 0.254: U4.4 88.9,29.31 88.9,26.2 88.6,25.9 74.6,25.9 73.99,25.29 R10.1
N$25  (via drill 0.3)
  Top 0.254: U4.5 87.63,29.31 v87.63,27.69 | R25.1 92.87,8.38 v94.23,8.38
  Bottom 0.254: v87.63,27.69 92.96,27.69 93.47,27.18 93.47,9.14 v94.23,8.38
N$26  (via drill 0.3)
  Top 0.254: U4.6 86.36,29.31 v86.36,27.43 | v86.36,10.67 84.06,8.37 R17.1
  Bottom 0.254: v86.36,27.43 v86.36,10.67
N$27  (via drill 0.3)
  Top 0.254: U4.7 85.09,29.31 v85.09,26.92 | v84.33,10.92 83.31,9.91 66.55,9.91 65.04,8.39 R4.1
  Bottom 0.254: v85.09,26.92 85.09,11.68 v84.33,10.92
N$28
  Top 0.254: U4.8 83.82,29.31 83.82,27.82 83,27 75,27 74.51,27.49 73.35,27.49 R9.1
N$30
  Top 0.254: R14.2 71.65,88.9 60.96,88.9 58.42,86.36 J21.2
N$44
  Top 0.254: 71.54,25.4 R10.2 70.94,26 61,26 60.83,25.83 J20.3
N$48
  Top 0.254: J20.2 58.29,27.56 58.93,28.19 71.08,28.19 R9.2
PROBE_IN
  Bottom 0.254: J11.2 15.5,84.83 U2.3.0
RADIO_RX_IN  (2 unrouted)
  Bottom 0.254: 51.75,64.77 57.99,71.01 57.99,74.12 WEMOS1.RX
RADIO_TX_OUT  (2 unrouted)
  Bottom 0.254: 46.35,67.31 53.85,74.8 56.13,74.8 WEMOS1.TX
RESET_IN  (via drill 0.3)
  Top 0.254: U2.15.3 12.01,54.61 9.5,52.1 9.5,46.4 11.02,44.88 11,44.86 v11,42
  Bottom 0.254: J8.2 11.02,41.98 v11,42
S1A1  (via drill 0.3)
  Top 0.254: v83.82,82.55 83.76,82.49 U3.21
  Bottom 0.254: v83.82,82.55 83.82,83.31 86.36,85.85 86.36,87.12 87.12,87.88 92.2,87.88 94.74,90.42 94.74,95.25 96.01,96.52 98.16,96.52 S103.A_1
S1AA
  Top 0.254: S103.A_A 96.38,94.97 R26.2
S1B1  (via drill 0.3)
  Top 0.254: v85.09,82.55 85.03,82.49 U3.22
  Top 0.305: 85.09,80.43 U3.22
  Bottom 0.254: v85.09,82.55 85.03,82.49 85.03,81.03 84.78,80.77 83.57,80.77 83.06,81.28 83.06,86.11 80.7,88.46 S103.B_1
S1BA
  Top 0.254: S103.B_A 83.71,94.97 R22.2
S1C1  (via drill 0.3)
  Top 0.254: v86.36,82.55 86.3,82.49 U3.23
  Bottom 0.254: v86.36,82.55 86.36,80.52 85.6,79.76 82.8,79.76 82.04,80.52 82.04,85.85 79.76,88.14 79.76,88.9 78.74,89.92 74.42,89.92 71.37,92.96 69.85,92.96 66.29,96.52 63.25,96.52 S103.C_1
S1CA
  Top 0.254: S103.C_A 60.88,94.97 R6.2
S2A1  (via drill 0.3)
  Top 0.254: v94.74,76.2 89.41,76.2 88.84,76.77 U3.25
  Bottom 0.254: v94.74,76.2 98,72.94 98,66.58 S100.A_1
S2AA
  Top 0.254: R23.2 91.09,65.72 S100.A_A
S2B1  (via drill 0.3)
  Top 0.254: U3.26 90.04,80.3 v90.04,77.85
  Bottom 0.254: v90.04,77.85 83.06,70.87 83.06,67.31 82.25,66.5 S100.B_1
S2BA
  Top 0.254: R18.2 73.82,65.58 S100.B_A
S2C1  (via drill 0.3)
  Top 0.254: v87.12,71.88 68.19,71.88 63.13,66.83 S100.C_1 | v91.44,78.49 91.38,78.55 U3.27
  Bottom 0.254: v87.12,71.88 91.44,76.2 v91.44,78.49
S2CA
  Top 0.254: R5.2 56.55,65.3 S100.C_A
S3A1  (via drill 0.3)
  Top 0.254: 83.82,19.77 U4.21 83.82,19.75 v83.82,17.78
  Bottom 0.254: v83.82,17.78 83.82,24.64 84.07,24.89 84.07,28.96 84.84,29.72 95.76,29.72 98.18,32.14 S102.A_1
S3AA
  Top 0.254: R24.2 91.11,35.8 S102.A_A
S3B1  (via drill 0.3)
  Top 0.254: 85.09,19.79 U4.22 85.11,22.08 84.84,22.35 v79.39,22.35
  Bottom 0.254: v79.39,22.35 79.39,29.79 79.6,30 79.6,35.4 S102.B_1
S3BA
  Top 0.254: R19.2 73.84,35.66 S102.B_A
S3C1  (via drill 0.3)
  Top 0.254: U4.23 86.36,19.79 86.36,22.91 85.83,23.44 77.03,23.44 v76.45,22.86
  Bottom 0.254: v76.45,22.86 73.15,22.86 63.23,32.78 S102.C_1
S3CA
  Top 0.254: R3.2 56.31,35.64 S102.C_A
S4A1  (via drill 0.3)
  Top 0.254: U4.25 88.9,19.75 88.9,16.76 89.15,16.51 v94.74,16.51
  Bottom 0.254: v94.74,16.51 95.76,15.49 95.76,7.62 96.88,6.5 S101.A_1
S4AA
  Top 0.254: R25.2 91.13,5.78 S101.A_A
S4B1  (via drill 0.3)
  Top 0.254: U4.26 90.17,19.75 v90.17,17.53
  Bottom 0.254: S101.B_1 80.7,7.29 82.3,8.89 88.39,8.89 90.17,10.67 v90.17,17.53
S4BA
  Top 0.254: R17.2 73.6,5.9 S101.B_A
S4C1  (via drill 0.3)
  Top 0.254: v91.69,17.53 91.46,17.76 U4.27 | S101.C_1 63.23,5.86 65.29,3.81 87.12,3.81 89.92,6.6 v89.92,8.89
  Bottom 0.254: v91.69,17.53 91.69,10.67 v89.92,8.89
S4CA
  Top 0.254: R4.2 56.33,5.62 S101.C_A
SD_CARD_CS
  Bottom 0.254: J16.4 U2.1.6
SPI_MISO
  Bottom 0.254: J16.6 40.64,72.39 U2.1.3
SPI_MOSI
  Bottom 0.254: U2.1.7 J16.3
SPI_SCK
  Bottom 0.254: U2.1.5 J16.5
SPINDLE_DIRECTION_OUT  (via drill 0.3)
  Top 0.254: v11,22 J6.2
  Bottom 0.254: U2.12.7 24.13,41.91 22.86,40.64 22.86,27.94 20.32,25.4 14.4,25.4 v11,22
SPINDLE_ENABLE_OUT  (via drill 0.3)
  Top 0.254: v11,24 9.19,24 J6.1
  Bottom 0.254: U2.12.6 22.61,44.45 21.34,43.18 21.34,29.21 20.07,27.94 14.94,27.94 v11,24
SPINDLE_SPEED_OUT  (via drill 0.3)
  Top 0.254: v11,20 11,18.19 J6.3
  Bottom 0.254: U2.2.7 25.4,39.37 24.13,38.1 24.13,27.94 19.05,22.86 13.86,22.86 v11,20
STEPPER_ENABLE_OUT  (via drill 0.3)
  Top 0.254: v12,34 14.95,34 U2.0.4
  Bottom 0.254: v12,34 12,33.19
VIN  (via drill 0.3)
  Top 0.254: R2.2 33.15,17.15 v33,17
  Bottom 0.254: v33,17 33,6.1
  Bottom 1.016: C1.+ 14.33,10.92 15.49,10.92 17.29,9.13 U1.1 17.39,6.1 33,6.1 43.19,6.1 | 43.19,6.1 46.99,6.1 J14.3 | J14.2 43.19,6.1
VIN_SCALED_IN
  Top 0.254: U2.2.0 36.69,23 R2.1 R1.2 C2.1
WHEEL_ENCODER_A_IN
  Top 0.254: J17.3 U2.12.2
WHEEL_ENCODER_B_IN
  Top 0.254: J17.2 U2.12.3
X_DIRECTION_OUT
  Bottom 0.254: J1.1 9.62,88.81 16.57,81.85 16.57,81.22 U2.3.1
X_LIMIT_IN
  Bottom 0.254: J1.3 14.25,81.19 15.3,80.14 15.3,74.87 U2.3.4
X_STEP_OUT
  Bottom 0.254: U2.3.3 17.78,75.12 16.19,76.71 16.19,80.64 11.68,85.15 4.15,85.15 J1.2
Y_DIRECTION_OUT
  Bottom 0.254: J2.1 12.82,74.81 U2.3.5
Y_LIMIT_IN
  Bottom 0.254: J2.3 15.36,67.19 U2.3.7
Y_STEP_OUT
  Bottom 0.254: J2.2 8.13,71 10.29,73.15 12.57,73.15 15.88,69.85 15.88,69.22 U2.3.6
Z_DIRECTION_OUT
  Bottom 0.254: U2.15.5 16.67,49.53 14.6,51.6 13.21,51.6 J3.1
Z_DISPLAY_RX_IN
  Bottom 0.254: J19.2 56.52,43.43 52.83,39.75 46.35,39.75 42.86,36.26 42.86,35.05 42.1,34.29 U2.2.5
Z_DISPLAY_TX_OUT
  Bottom 0.254: J19.1 52.7,41.21 52.01,40.51 45.85,40.51 42.1,36.77 38.16,36.77 U2.2.6
Z_LIMIT_IN
  Bottom 0.254: U2.0.1 12.74,44.45 J3.3
Z_STEP_OUT
  Bottom 0.254: J3.2 6.5,57 12.9,50.6 14.4,50.6 15.3,49.7 15.3,47.6 15.9,47 U2.0.0

### Text on the board
tPlace: ERROR | HOLDING | PROBE | MOTOR / CURRENT | I/O SPARE 1 | X | CYCLE / START | SD CARD/SPI | Y | WHEEL | CPU SPARE | Z | FEED / HOLD | 5V0 | A | RESET | Z DISP | I2C DISP | FEED / OVERRIDE | COOLANT | I/O SPARE 2 | SPINDLE | GND | 5V0 | Hyatt CNC Controller / 180804 / v1.0 / ValveStudio | VIN | - | +